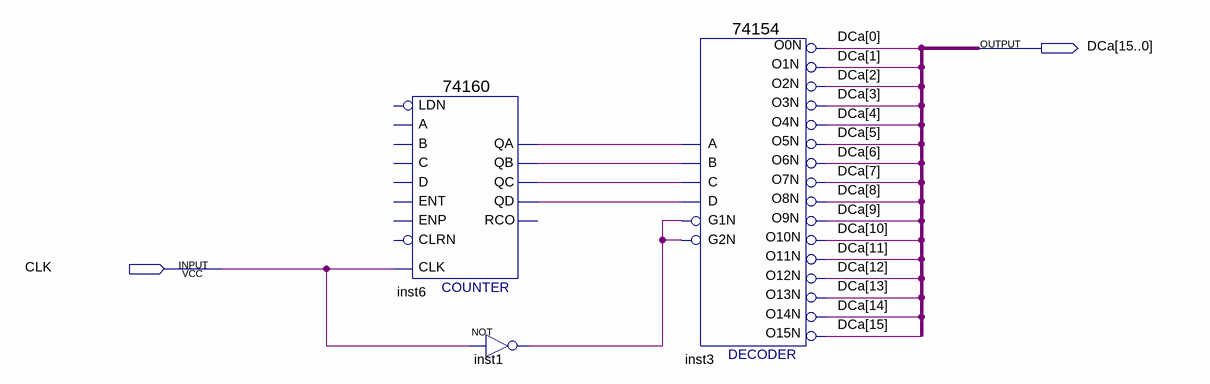
[diagram p0: schematic sheet]
// Quartus schematic DCA.bdf as structural Verilog: 3 symbols, 2 pins
module DCA (
  input  CLK,
  output [15:0] DCa
);

  wire inst1_out, inst6_qa, inst6_qb, inst6_qc, inst6_qd;

  \74160  inst6 (
    .CLK(CLK), .QD(inst6_qd), .QA(inst6_qa), .QB(inst6_qb), .QC(inst6_qc));  // open: ENT, A, B, C, D, LDN, ENP, CLRN, RCO
  not inst1 (inst1_out, CLK);
  \74154  inst3 (
    .C(inst6_qc), .D(inst6_qd), .B(inst6_qb), .A(inst6_qa), .G1N(inst1_out), .G2N(inst1_out), .O0N(DCa[0]),
    .O12N(DCa[12]), .O15N(DCa[15]), .O10N(DCa[10]), .O11N(DCa[11]), .O1N(DCa[1]), .O13N(DCa[13]),
    .O14N(DCa[14]), .O4N(DCa[4]), .O3N(DCa[3]), .O2N(DCa[2]), .O7N(DCa[7]), .O6N(DCa[6]), .O5N(DCa[5]),
    .O9N(DCa[9]), .O8N(DCa[8]));
endmodule
